# Altium schematic sheet 03-WWVB_Path.SchDoc
size B; SheetNumber: 3; SheetTotal: 12
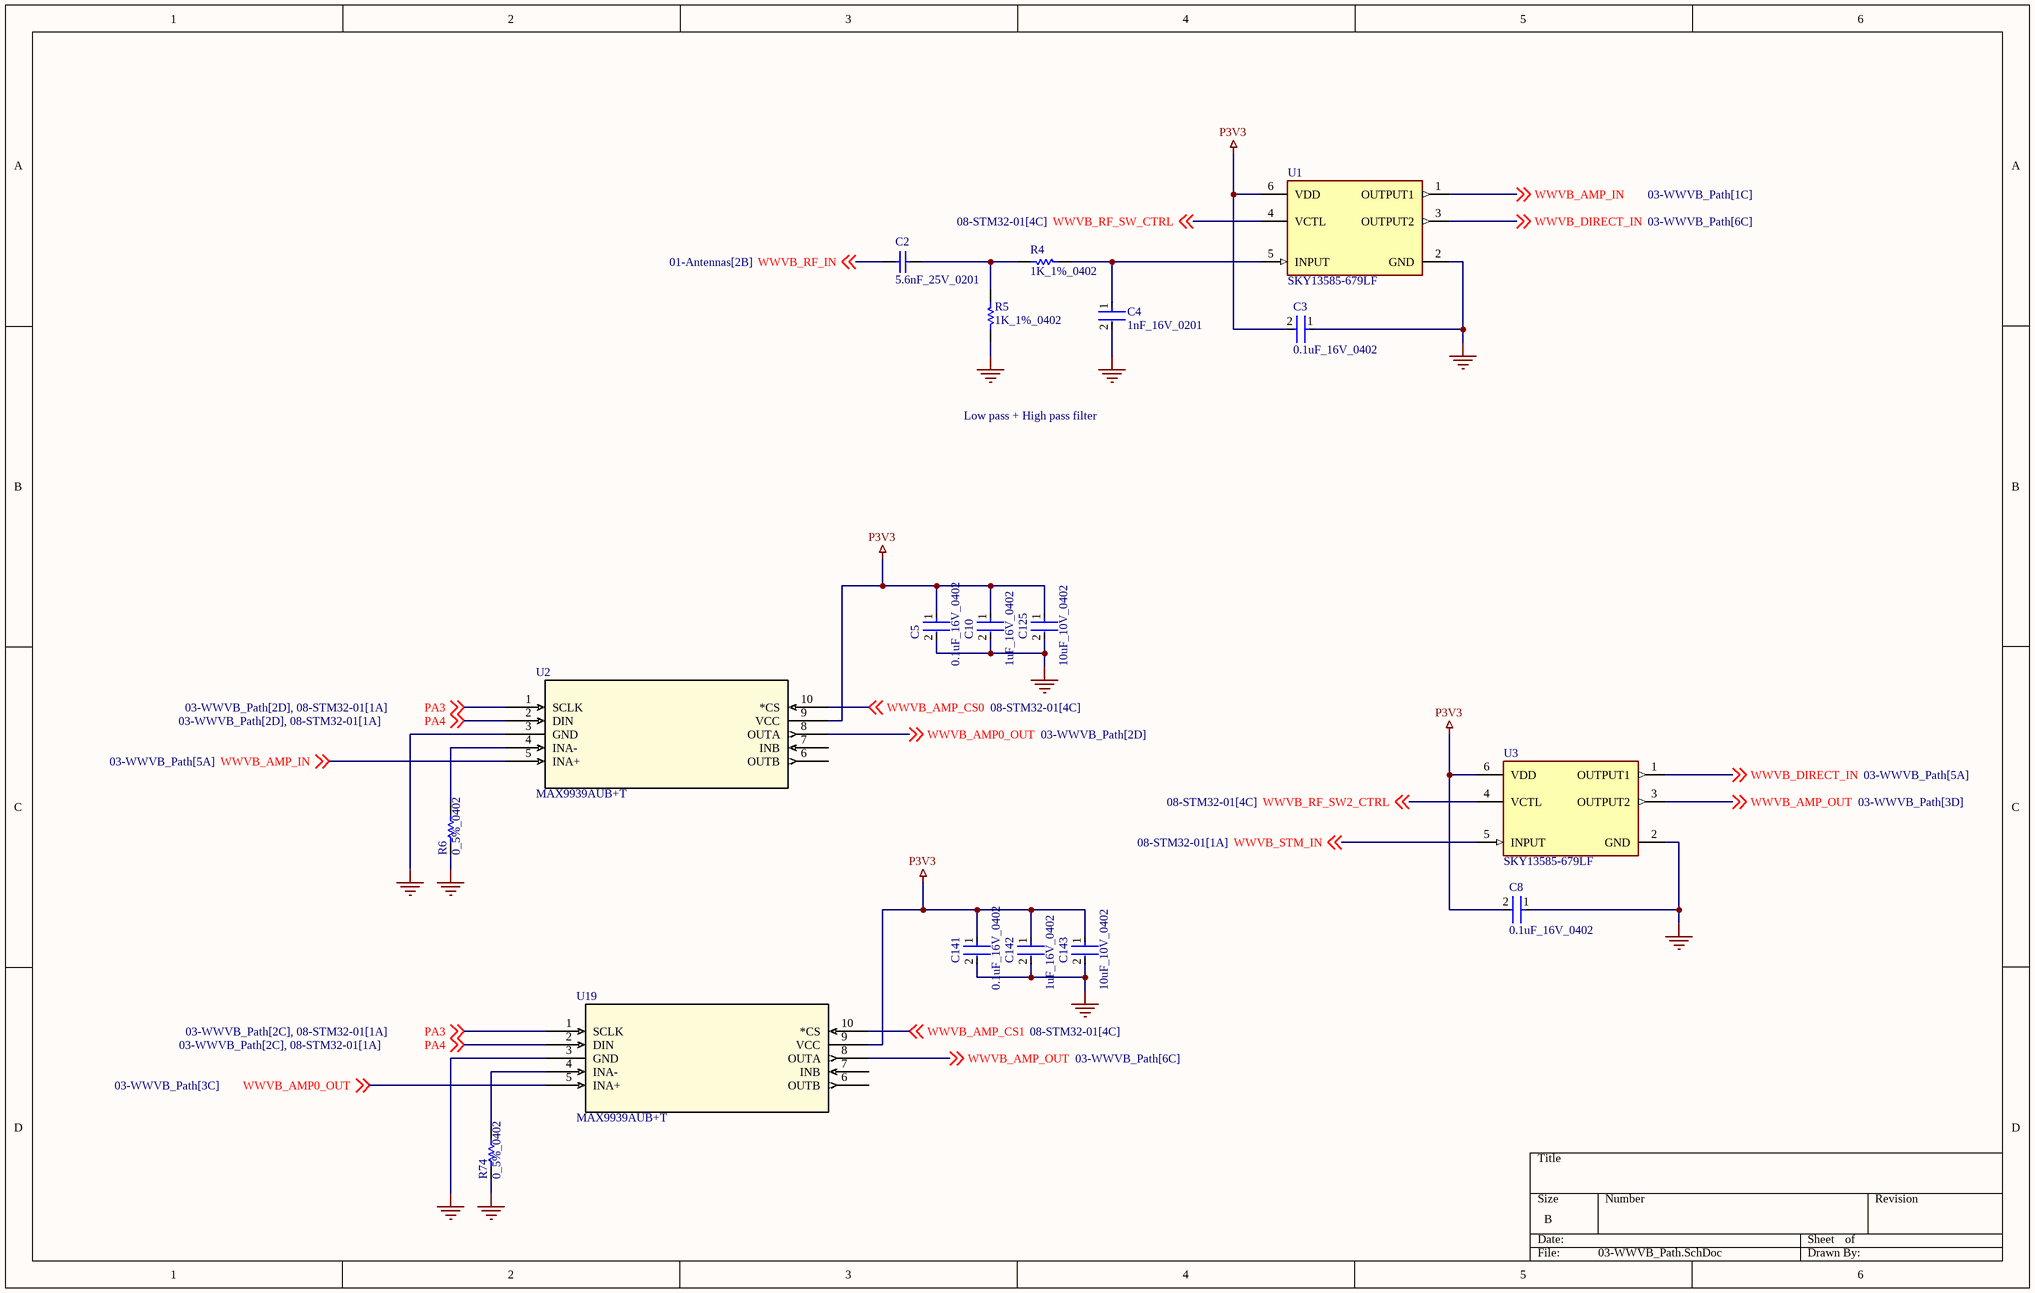
[diagram p0: 03-WWVB_Path.SchDoc]

## Parts
C2  5.6nF_25V_0201  [CAPC0603X33X15ML03T05]
C3  0.1uF_16V_0402  [FP-C0402-BB-MFG]
C4  1nF_16V_0201  [FP-0201-L_0_6_0_09-W_0_3-MFG]
C5  0.1uF_16V_0402  [FP-C0402-BB-MFG]
C8  0.1uF_16V_0402  [FP-C0402-BB-MFG]
C10  1uF_16V_0402  [FP-0402-L_1_0_0_05-W_0_5-IPC_A]
C125  10uF_10V_0402  [FP-CL05A106MP5NUNC-MFG]
C141  0.1uF_16V_0402  [FP-C0402-BB-MFG]
C142  1uF_16V_0402  [FP-0402-L_1_0_0_05-W_0_5-IPC_A]
C143  10uF_10V_0402  [FP-CL05A106MP5NUNC-MFG]
R4  1K_1%_0402  [RESC1005X40X25NL05T05]
R5  1K_1%_0402  [RESC1005X40X25NL05T05]
R6  0_5%_0402  [RESC1005X40X25NL05T10]
R74  0_5%_0402  [RESC1005X40X25NL05T10]
U1  SKY13585-679LF  [FP-SKY13585-679LF-MFG]
U2  MAX9939AUB+T  [21-0061L_MXM]
U3  SKY13585-679LF  [FP-SKY13585-679LF-MFG]
U19  MAX9939AUB+T  [21-0061L_MXM]

## Nets
GND: C3.1 C4.2 C5.2 C8.1 C10.2 C125.2 C141.2 C142.2 C143.2 R5.1 R6.1 R74.1 U1.2(GND) U2.3(GND) U3.2(GND) U19.3(GND)
P3V3: C3.2 C5.1 C8.2 C10.1 C125.1 C141.1 C142.1 C143.1 U1.6(VDD) U2.9(VCC) U3.6(VDD) U19.9(VCC)
PA3: U2.1(SCLK) U19.1(SCLK) ; off-sheet PA3
PA4: U2.2(DIN) U19.2(DIN) ; off-sheet PA4
WWVB_AMP0_OUT: U2.8(OUTA) U19.5(INA+) ; off-sheet WWVB_AMP0_OUT
WWVB_AMP_CS0: U2.10(*CS) ; off-sheet WWVB_AMP_CS0
WWVB_AMP_CS1: U19.10(*CS) ; off-sheet WWVB_AMP_CS1
WWVB_AMP_IN: U1.1(OUTPUT1) U2.5(INA+) ; off-sheet WWVB_AMP_IN
WWVB_AMP_OUT: U3.3(OUTPUT2) U19.8(OUTA) ; off-sheet WWVB_AMP_OUT
WWVB_DIRECT_IN: U1.3(OUTPUT2) U3.1(OUTPUT1) ; off-sheet WWVB_DIRECT_IN
WWVB_RF_IN: C2.1 ; off-sheet WWVB_RF_IN
WWVB_RF_SW2_CTRL: U3.4(VCTL) ; off-sheet WWVB_RF_SW2_CTRL
WWVB_RF_SW_CTRL: U1.4(VCTL) ; off-sheet WWVB_RF_SW_CTRL
WWVB_STM_IN: U3.5(INPUT) ; off-sheet WWVB_STM_IN
NetC2_2: C2.2 R4.2 R5.2
NetC4_1: C4.1 R4.1 U1.5(INPUT)
NetR6_2: R6.2 U2.4(INA-)
NetR74_2: R74.2 U19.4(INA-)

Not connected (* = marked no-connect by the designer): U2 6(OUTB) 7(INB); U19 6(OUTB) 7(INB)

## Notes on the sheet
- Low pass + High pass filter

## Library data of the parts
C2 = CMP-2010-01745-1: Part Number: MC000322; Manufacturer: Multicomp
C3 C5 C8 C141 = CMP-1034-02068-3: CAP CER 0.1UF 16V 5% X7R 0402; Manufacturer: Kemet; Manufacturer Part Number: C0402C104J4RACTU; Value: 0.10 μF; Temperature Coefficient: 15%; Tolerance: 0.05; Material: Ceramic; ComponentLink2URL: https://content.kemet.com/datasheets/KEM_C1002_X7R_SMD.pdf; Automotive: No; Device Class L2: Capacitors; Temperature: -55°C to +125°C; RoHS: TRUE; Voltage Rating: 16 V; ComponentLink2Description: Datasheet; Device Class L3: Ceramic Capacitors; Temperature Range Low: -55°C; Ipc Land Pattern Name: CAPC10050X50; Device Class L1: Passive Components; Temperature Range High: +125°C; Package: C0402-BB; Capacitance: 0.10 μF; Category: Cap; Mouser Description: CAP CER 0.1UF 16V X7R 0402; Height: 0.55mm; Digikey Description: CAP CER 0.1UF 16V 5% X7R 0402; Octopart: https://octopart.com/c0402c104j4ractu-kemet-12573893; Temperature Characteristic: X7R; Lead Free: Yes
C4 = CMP-2010-00182-2: General Purpose Ceramic Capacitor, 0201, 1nF, 10%, X7R, 15%, 16V; Dissipation Factor: 12.5%; Insulation Resistance: 100GR; Lead Free: Lead Free; Thickness: 0.013inch; Height: 0.33mm; Dielectric: X7R; Voltage Rating: 16V; Max Operating Temperature: 125°C; RoHS Compliant: Yes; Voltage: 16V; Package Quantity: 1; Mount: Surface Mount; Voltage Rating (DC): 16V; Dielectric Material: Ceramic; Termination: SMD/SMT; REACH SVHC: No SVHC; Case Code (Metric): 0603; Length: 0.6mm; Case/Package: 0201; Width: 0.012inch; Case Code (Imperial): 0201; Radiation Hardening: No; Tolerance: 10%; Series: -; Number of Pins: 2; Min Operating Temperature: -55°C; Capacitance: 1nF; Construction: Flat; Depth: 0.3mm; Packaging: Tape and Reel
C10 C142 = CMP-14477-000104-2: None; Tolerance: 10%; Voltage Rating: 16V; Dielectric: X5R; Capacitance: 1uF; Packaging: Tape and Reel; Depth: 0.5mm; Mount: Surface Mount; Thickness: 0.022inch; Package Quantity: 1; Min Operating Temperature: -55°C; Series: M; Voltage Rating (DC): 16V; Termination: SMD/SMT; Case/Package: 0402; Number of Pins: 2; Case Code (Imperial): 0402; Length: 1mm; Halogen Free: Halogen Free; Case Code (Metric): 1005; Width: 0.02inch; RoHS Compliant: Yes; Radiation Hardening: No; Max Operating Temperature: 85°C; Height: 0.5mm; Construction: Flat
C125 C143 = CMP-13271-000002-1: CAP CER 10UF 10V X5R 0402; Manufacturer Part Number: CL05A106MP5NUNC; Manufacturer: Samsung; Temperature Coefficient: 15%; Tolerance: 20%; Material: Ceramic; Octopart: https://octopart.com/cl05a106mp5nunc-samsung-22457395; Voltage Rating: 10V; RoHS: TRUE; Value: 10uF; Height: 0.7mm; Digikey Description: CAP CER 10UF 10V X5R 0402; Automotive: No; Package: CL05A106MP5NUNC; Device Class L1: Passive Components; Capacitance: 10uF; Temperature Range High: +85°C; ComponentLink2Description: Datasheet; Device Class L2: Capacitors; Temperature Characteristic: X5R; Temperature: -55°C to +85°C; ComponentLink2URL: http://www.samsungsem.com/kr/support/product-search/mlcc/__icsFiles/afieldfile/2019/05/10/19-CL05A106MP5NUNC.pdf; Device Class L3: Ceramic Capacitors; Category: Cap; Temperature Range Low: -55°C; Ipc Land Pattern Name: CAPC10050X50; Lead Free: Yes
R4 R5 = CMP-2002-08277-1: Manufacturer: Vishay Dale; Part Number: CRCW04021K00FKTD
R6 R74 = CMP-2002-06457-1: Manufacturer: Panasonic; Part Number: ERJ-U020R00X
U1 U3 = CMP-85923-000009-1: IC RF SWITCH SPDT 6GHZ 6MLPD; Insertion Loss: 0.5dB; Impedance: 50R; IIP3: 56dBm; Test Frequency: 2.5GHz; Packaging: Cut Tape; Throw Configuration: SPDT; Max Operating Temperature: 90°C; RoHS Compliant: Yes; Min Operating Temperature: -40°C; Series: -
U2 U19 = MAX9939AUB+T: No Description Available; Mfr_Name: Analog Devices Inc; Copyright: Copyright (C) 2023 Ultra Librarian. All rights reserved.; Manufacturer_Part_Number: MAX9939AUB+T; RefDes: RefDes; Type: DEV